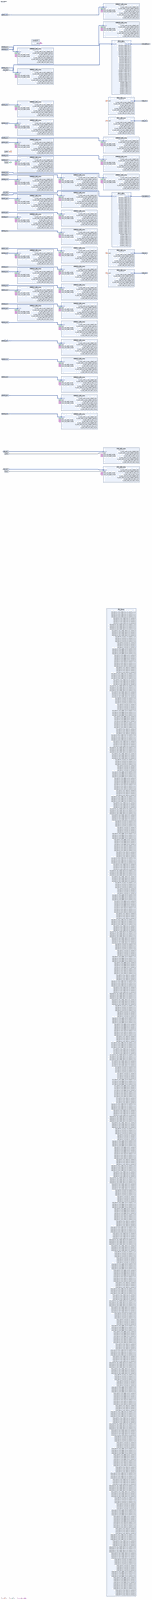
[diagram p0: block diagram of the top level, whole]
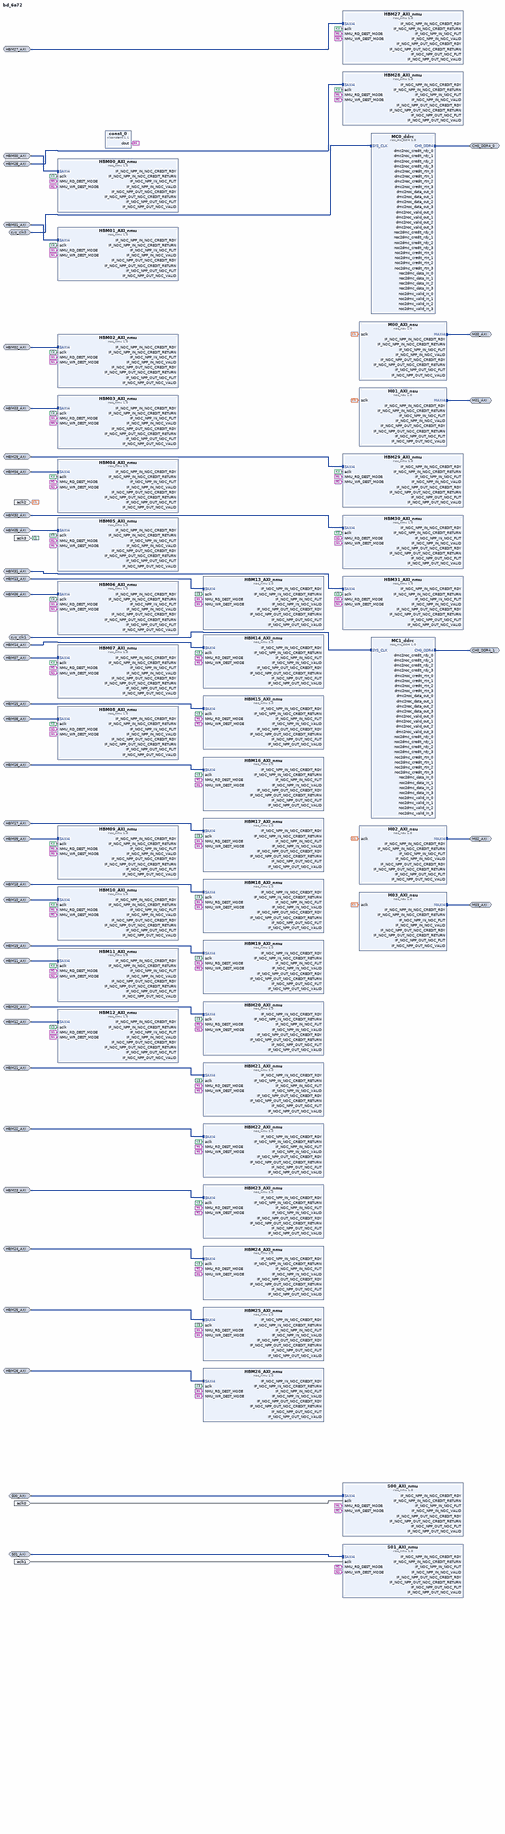
[diagram p1: block diagram of the top level, upper part]
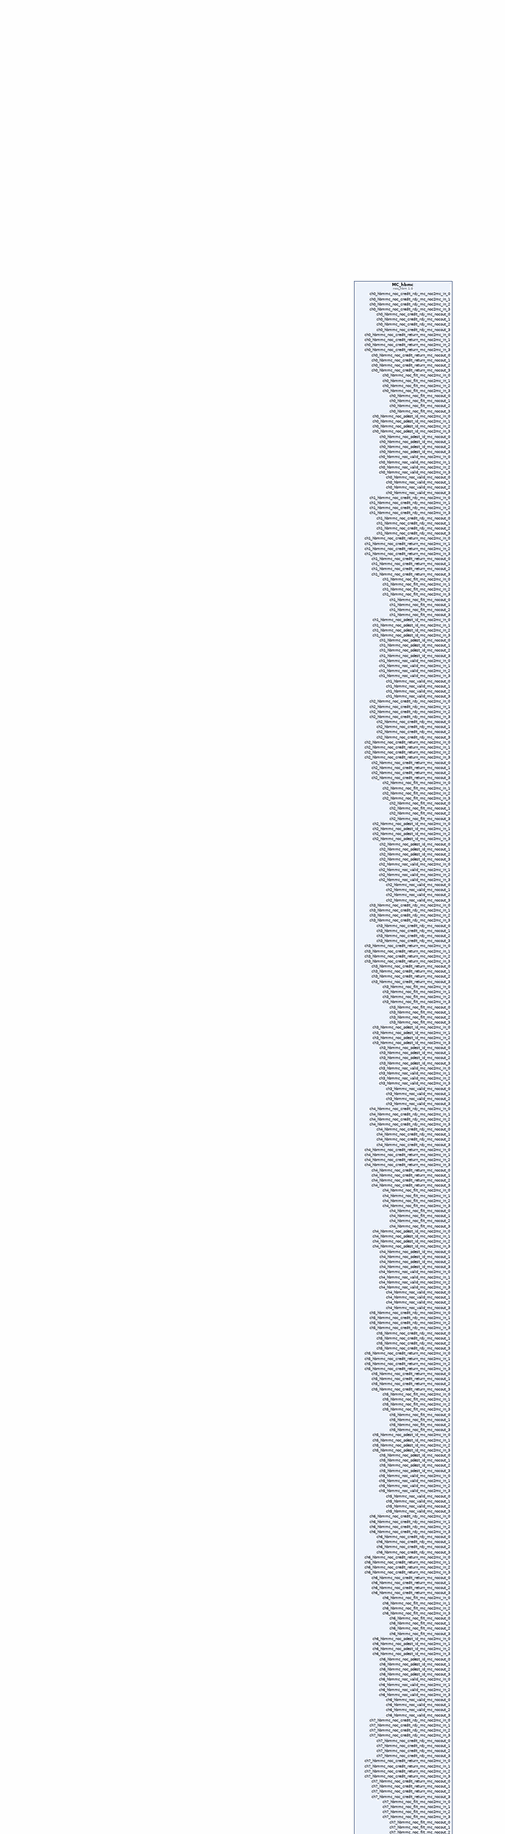
[diagram p2: block diagram of the top level, middle part]
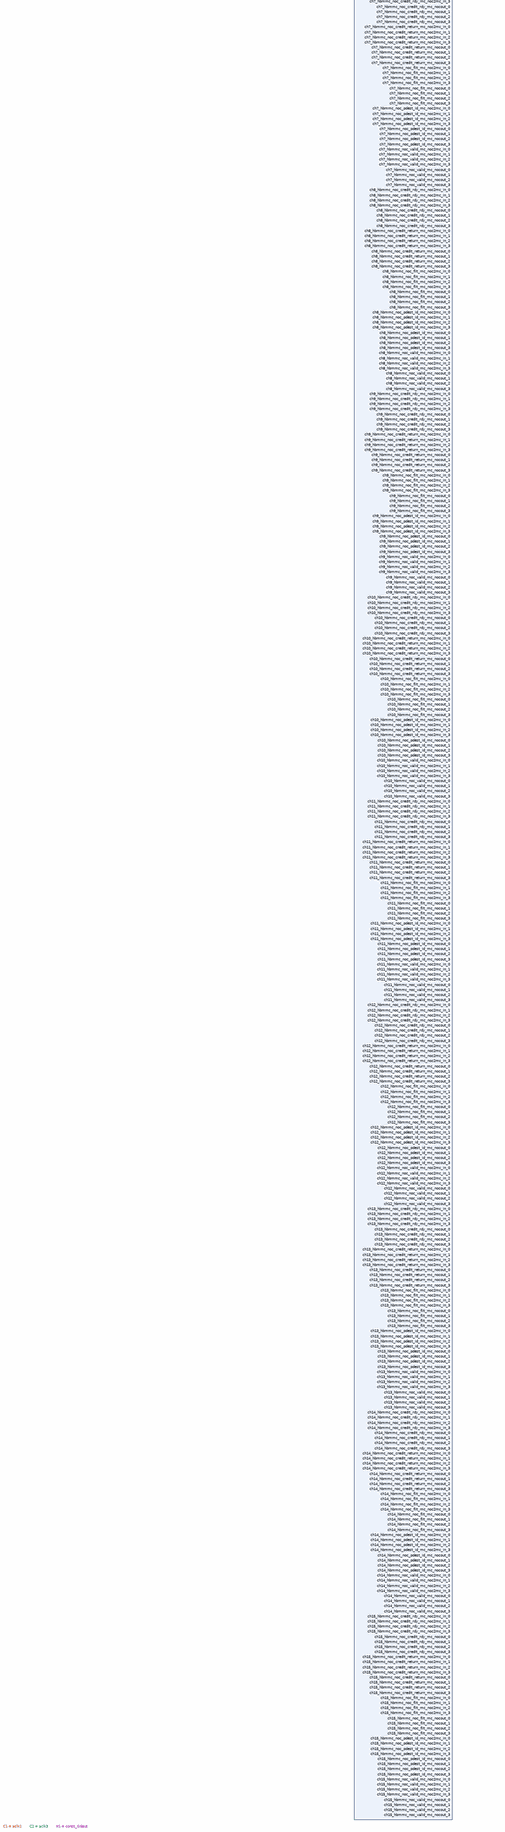
[diagram p3: block diagram of the top level, lower part]
# Vivado block design bd_6a72, xcvh1582-vsva3697-2MP-e-S, Vivado 2024.2
create_bd_design bd_6a72

create_bd_intf_port -mode Slave -vlnv xilinx.com:interface:aximm_rtl:1.0 S00_AXI
set_property -dict [list \
  CONFIG.CATEGORY ps_pcie \
  CONFIG.CONNECTIONS {['HBM10_PORT2 {read_bw {100} write_bw {100} read_avg_burst {4} write_avg_burst {4}}', 'HBM15_PORT0 {read_bw {100} write_bw {100} read_avg_burst {4} write_avg_burst {4}}', 'M01_AXI {read_bw {100} write_bw {100} read_avg_burst {4} write_avg_burst {4}}', 'HBM10_PORT0 {read_bw {100} write_bw {100} read_avg_burst {4} write_avg_burst {4}}', 'HBM5_PORT0 {read_bw {100} write_bw {100} read_avg_burst {4} write_avg_burst {4}}', 'HBM15_PORT2 {read_bw {100} write_bw {100} read_avg_burst {4} write_avg_burst {4}}', 'HBM5_PORT2 {read_bw {100} write_bw {100} read_avg_burst {4} write_avg_burst {4}}', 'HBM1_PORT0 {read_bw {100} write_bw {100} read_avg_burst {4} write_avg_burst {4}}', 'HBM1_PORT2 {read_bw {100} write_bw {100} read_avg_burst {4} write_avg_burst {4}}', 'HBM6_PORT0 {read_bw {100} write_bw {100} read_avg_burst {4} write_avg_burst {4}}', 'HBM12_PORT0 {read_bw {100} write_bw {100} read_avg_burst {4} write_avg_burst {4}}', 'HBM0_PORT2 {read_bw {100} write_bw {100} read_avg_burst {4} write_avg_burst {4}}', 'HBM6_PORT2 {read_bw {100} write_bw {100} read_avg_burst {4} write_avg_burst {4}}', 'HBM14_PORT2 {read_bw {100} write_bw {100} read_avg_burst {4} write_avg_burst {4}}', 'HBM12_PORT2 {read_bw {100} write_bw {100} read_avg_burst {4} write_avg_burst {4}}', 'M02_AXI {read_bw {100} write_bw {100} read_avg_burst {4} write_avg_burst {4}}', 'HBM0_PORT0 {read_bw {100} write_bw {100} read_avg_burst {4} write_avg_burst {4}}', 'HBM8_PORT0 {read_bw {100} write_bw {100} read_avg_burst {4} write_avg_burst {4}}', 'HBM8_PORT2 {read_bw {100} write_bw {100} read_avg_burst {4} write_avg_burst {4}}', 'HBM14_PORT0 {read_bw {100} write_bw {100} read_avg_burst {4} write_avg_burst {4}}', 'HBM3_PORT0 {read_bw {100} write_bw {100} read_avg_burst {4} write_avg_burst {4}}', 'HBM3_PORT2 {read_bw {100} write_bw {100} read_avg_burst {4} write_avg_burst {4}}', 'HBM4_PORT2 {read_bw {100} write_bw {100} read_avg_burst {4} write_avg_burst {4}}', 'M03_AXI {read_bw {100} write_bw {100} read_avg_burst {4} write_avg_burst {4}}', 'HBM4_PORT0 {read_bw {100} write_bw {100} read_avg_burst {4} write_avg_burst {4}}', 'MC_0 {read_bw {100} write_bw {100} read_avg_burst {4} write_avg_burst {4}}', 'HBM9_PORT0 {read_bw {100} write_bw {100} read_avg_burst {4} write_avg_burst {4}}', 'HBM2_PORT0 {read_bw {100} write_bw {100} read_avg_burst {4} write_avg_burst {4}}', 'HBM11_PORT0 {read_bw {100} write_bw {100} read_avg_burst {4} write_avg_burst {4}}', 'HBM9_PORT2 {read_bw {100} write_bw {100} read_avg_burst {4} write_avg_burst {4}}', 'HBM11_PORT2 {read_bw {100} write_bw {100} read_avg_burst {4} write_avg_burst {4}}', 'HBM7_PORT2 {read_bw {100} write_bw {100} read_avg_burst {4} write_avg_burst {4}}', 'HBM13_PORT2 {read_bw {100} write_bw {100} read_avg_burst {4} write_avg_burst {4}}', 'HBM7_PORT0 {read_bw {100} write_bw {100} read_avg_burst {4} write_avg_burst {4}}', 'HBM13_PORT0 {read_bw {100} write_bw {100} read_avg_burst {4} write_avg_burst {4}}', 'HBM2_PORT2 {read_bw {100} write_bw {100} read_avg_burst {4} write_avg_burst {4}}', 'M00_AXI {read_bw {100} write_bw {100} read_avg_burst {4} write_avg_burst {4}}']} \
  CONFIG.DEST_IDS M01_AXI:0x80:M02_AXI:0xc0:M03_AXI:0x40:M00_AXI:0x100 \
] [get_bd_intf_ports S00_AXI]
create_bd_intf_port -mode Slave -vlnv xilinx.com:interface:aximm_rtl:1.0 S01_AXI
set_property -dict [list \
  CONFIG.CATEGORY ps_pcie \
  CONFIG.CONNECTIONS {['HBM10_PORT2 {read_bw {100} write_bw {100} read_avg_burst {4} write_avg_burst {4}}', 'HBM15_PORT0 {read_bw {100} write_bw {100} read_avg_burst {4} write_avg_burst {4}}', 'M01_AXI {read_bw {100} write_bw {100} read_avg_burst {4} write_avg_burst {4}}', 'HBM10_PORT0 {read_bw {100} write_bw {100} read_avg_burst {4} write_avg_burst {4}}', 'HBM5_PORT0 {read_bw {100} write_bw {100} read_avg_burst {4} write_avg_burst {4}}', 'HBM15_PORT2 {read_bw {100} write_bw {100} read_avg_burst {4} write_avg_burst {4}}', 'HBM5_PORT2 {read_bw {100} write_bw {100} read_avg_burst {4} write_avg_burst {4}}', 'HBM1_PORT0 {read_bw {100} write_bw {100} read_avg_burst {4} write_avg_burst {4}}', 'HBM1_PORT2 {read_bw {100} write_bw {100} read_avg_burst {4} write_avg_burst {4}}', 'HBM6_PORT0 {read_bw {100} write_bw {100} read_avg_burst {4} write_avg_burst {4}}', 'HBM12_PORT0 {read_bw {100} write_bw {100} read_avg_burst {4} write_avg_burst {4}}', 'HBM0_PORT2 {read_bw {100} write_bw {100} read_avg_burst {4} write_avg_burst {4}}', 'HBM6_PORT2 {read_bw {100} write_bw {100} read_avg_burst {4} write_avg_burst {4}}', 'HBM14_PORT2 {read_bw {100} write_bw {100} read_avg_burst {4} write_avg_burst {4}}', 'HBM12_PORT2 {read_bw {100} write_bw {100} read_avg_burst {4} write_avg_burst {4}}', 'M02_AXI {read_bw {100} write_bw {100} read_avg_burst {4} write_avg_burst {4}}', 'HBM0_PORT0 {read_bw {100} write_bw {100} read_avg_burst {4} write_avg_burst {4}}', 'HBM8_PORT0 {read_bw {100} write_bw {100} read_avg_burst {4} write_avg_burst {4}}', 'HBM8_PORT2 {read_bw {100} write_bw {100} read_avg_burst {4} write_avg_burst {4}}', 'HBM14_PORT0 {read_bw {100} write_bw {100} read_avg_burst {4} write_avg_burst {4}}', 'HBM3_PORT0 {read_bw {100} write_bw {100} read_avg_burst {4} write_avg_burst {4}}', 'HBM3_PORT2 {read_bw {100} write_bw {100} read_avg_burst {4} write_avg_burst {4}}', 'HBM4_PORT2 {read_bw {100} write_bw {100} read_avg_burst {4} write_avg_burst {4}}', 'M03_AXI {read_bw {100} write_bw {100} read_avg_burst {4} write_avg_burst {4}}', 'HBM4_PORT0 {read_bw {100} write_bw {100} read_avg_burst {4} write_avg_burst {4}}', 'MC_0 {read_bw {100} write_bw {100} read_avg_burst {4} write_avg_burst {4}}', 'HBM9_PORT0 {read_bw {100} write_bw {100} read_avg_burst {4} write_avg_burst {4}}', 'HBM2_PORT0 {read_bw {100} write_bw {100} read_avg_burst {4} write_avg_burst {4}}', 'HBM11_PORT0 {read_bw {100} write_bw {100} read_avg_burst {4} write_avg_burst {4}}', 'HBM9_PORT2 {read_bw {100} write_bw {100} read_avg_burst {4} write_avg_burst {4}}', 'HBM11_PORT2 {read_bw {100} write_bw {100} read_avg_burst {4} write_avg_burst {4}}', 'HBM7_PORT2 {read_bw {100} write_bw {100} read_avg_burst {4} write_avg_burst {4}}', 'HBM13_PORT2 {read_bw {100} write_bw {100} read_avg_burst {4} write_avg_burst {4}}', 'HBM7_PORT0 {read_bw {100} write_bw {100} read_avg_burst {4} write_avg_burst {4}}', 'HBM13_PORT0 {read_bw {100} write_bw {100} read_avg_burst {4} write_avg_burst {4}}', 'HBM2_PORT2 {read_bw {100} write_bw {100} read_avg_burst {4} write_avg_burst {4}}', 'M00_AXI {read_bw {100} write_bw {100} read_avg_burst {4} write_avg_burst {4}}']} \
  CONFIG.DEST_IDS M01_AXI:0x80:M02_AXI:0xc0:M03_AXI:0x40:M00_AXI:0x100 \
] [get_bd_intf_ports S01_AXI]
create_bd_intf_port -mode Slave -vlnv xilinx.com:interface:aximm_rtl:1.0 HBM00_AXI
set_property -dict [list \
  CONFIG.CATEGORY pl_hbm \
  CONFIG.CONNECTIONS {HBM0_PORT0 {read_bw {12800} write_bw {6400} read_avg_burst {4} write_avg_burst {4}}} \
  CONFIG.DATA_WIDTH 256 \
  CONFIG.ID_WIDTH 6 \
  CONFIG.R_TRAFFIC_CLASS BEST_EFFORT \
] [get_bd_intf_ports HBM00_AXI]
create_bd_intf_port -mode Slave -vlnv xilinx.com:interface:aximm_rtl:1.0 HBM01_AXI
set_property -dict [list \
  CONFIG.CATEGORY pl_hbm \
  CONFIG.CONNECTIONS {HBM0_PORT2 {read_bw {12800} write_bw {6400} read_avg_burst {4} write_avg_burst {4}}} \
  CONFIG.DATA_WIDTH 256 \
  CONFIG.ID_WIDTH 6 \
] [get_bd_intf_ports HBM01_AXI]
create_bd_intf_port -mode Slave -vlnv xilinx.com:interface:aximm_rtl:1.0 HBM02_AXI
set_property -dict [list \
  CONFIG.CATEGORY pl_hbm \
  CONFIG.CONNECTIONS {HBM1_PORT0 {read_bw {12800} write_bw {6400} read_avg_burst {4} write_avg_burst {4}}} \
  CONFIG.DATA_WIDTH 256 \
  CONFIG.ID_WIDTH 6 \
] [get_bd_intf_ports HBM02_AXI]
create_bd_intf_port -mode Slave -vlnv xilinx.com:interface:aximm_rtl:1.0 HBM03_AXI
set_property -dict [list \
  CONFIG.CATEGORY pl_hbm \
  CONFIG.CONNECTIONS {HBM1_PORT2 {read_bw {12800} write_bw {6400} read_avg_burst {4} write_avg_burst {4}}} \
  CONFIG.DATA_WIDTH 256 \
  CONFIG.ID_WIDTH 6 \
] [get_bd_intf_ports HBM03_AXI]
create_bd_intf_port -mode Slave -vlnv xilinx.com:interface:aximm_rtl:1.0 HBM04_AXI
set_property -dict [list \
  CONFIG.CATEGORY pl_hbm \
  CONFIG.CONNECTIONS {HBM2_PORT0 {read_bw {12800} write_bw {6400} read_avg_burst {4} write_avg_burst {4}}} \
  CONFIG.DATA_WIDTH 256 \
  CONFIG.ID_WIDTH 6 \
] [get_bd_intf_ports HBM04_AXI]
create_bd_intf_port -mode Slave -vlnv xilinx.com:interface:aximm_rtl:1.0 HBM05_AXI
set_property -dict [list \
  CONFIG.CATEGORY pl_hbm \
  CONFIG.CONNECTIONS {HBM2_PORT2 {read_bw {12800} write_bw {6400} read_avg_burst {4} write_avg_burst {4}}} \
  CONFIG.DATA_WIDTH 256 \
  CONFIG.ID_WIDTH 6 \
] [get_bd_intf_ports HBM05_AXI]
create_bd_intf_port -mode Slave -vlnv xilinx.com:interface:aximm_rtl:1.0 HBM06_AXI
set_property -dict [list \
  CONFIG.CATEGORY pl_hbm \
  CONFIG.CONNECTIONS {HBM3_PORT0 {read_bw {12800} write_bw {6400} read_avg_burst {4} write_avg_burst {4}}} \
  CONFIG.DATA_WIDTH 256 \
  CONFIG.ID_WIDTH 6 \
] [get_bd_intf_ports HBM06_AXI]
create_bd_intf_port -mode Slave -vlnv xilinx.com:interface:aximm_rtl:1.0 HBM07_AXI
set_property -dict [list \
  CONFIG.CATEGORY pl_hbm \
  CONFIG.CONNECTIONS {HBM3_PORT2 {read_bw {12800} write_bw {6400} read_avg_burst {4} write_avg_burst {4}}} \
  CONFIG.DATA_WIDTH 256 \
  CONFIG.ID_WIDTH 6 \
] [get_bd_intf_ports HBM07_AXI]
create_bd_intf_port -mode Slave -vlnv xilinx.com:interface:aximm_rtl:1.0 HBM08_AXI
set_property -dict [list \
  CONFIG.CATEGORY pl_hbm \
  CONFIG.CONNECTIONS {HBM4_PORT0 {read_bw {12800} write_bw {6400} read_avg_burst {4} write_avg_burst {4}}} \
  CONFIG.DATA_WIDTH 256 \
  CONFIG.ID_WIDTH 6 \
] [get_bd_intf_ports HBM08_AXI]
create_bd_intf_port -mode Slave -vlnv xilinx.com:interface:aximm_rtl:1.0 HBM09_AXI
set_property -dict [list \
  CONFIG.CATEGORY pl_hbm \
  CONFIG.CONNECTIONS {HBM4_PORT2 {read_bw {12800} write_bw {6400} read_avg_burst {4} write_avg_burst {4}}} \
  CONFIG.DATA_WIDTH 256 \
  CONFIG.ID_WIDTH 6 \
] [get_bd_intf_ports HBM09_AXI]
create_bd_intf_port -mode Slave -vlnv xilinx.com:interface:aximm_rtl:1.0 HBM10_AXI
set_property -dict [list \
  CONFIG.CATEGORY pl_hbm \
  CONFIG.CONNECTIONS {HBM5_PORT0 {read_bw {12800} write_bw {6400} read_avg_burst {4} write_avg_burst {4}}} \
  CONFIG.DATA_WIDTH 256 \
  CONFIG.ID_WIDTH 6 \
] [get_bd_intf_ports HBM10_AXI]
create_bd_intf_port -mode Slave -vlnv xilinx.com:interface:aximm_rtl:1.0 HBM11_AXI
set_property -dict [list \
  CONFIG.CATEGORY pl_hbm \
  CONFIG.CONNECTIONS {HBM5_PORT2 {read_bw {12800} write_bw {6400} read_avg_burst {4} write_avg_burst {4}}} \
  CONFIG.DATA_WIDTH 256 \
  CONFIG.ID_WIDTH 6 \
] [get_bd_intf_ports HBM11_AXI]
create_bd_intf_port -mode Slave -vlnv xilinx.com:interface:aximm_rtl:1.0 HBM12_AXI
set_property -dict [list \
  CONFIG.CATEGORY pl_hbm \
  CONFIG.CONNECTIONS {HBM6_PORT0 {read_bw {12800} write_bw {6400} read_avg_burst {4} write_avg_burst {4}}} \
  CONFIG.DATA_WIDTH 256 \
  CONFIG.ID_WIDTH 6 \
] [get_bd_intf_ports HBM12_AXI]
create_bd_intf_port -mode Slave -vlnv xilinx.com:interface:aximm_rtl:1.0 HBM13_AXI
set_property -dict [list \
  CONFIG.CATEGORY pl_hbm \
  CONFIG.CONNECTIONS {HBM6_PORT2 {read_bw {12800} write_bw {6400} read_avg_burst {4} write_avg_burst {4}}} \
  CONFIG.DATA_WIDTH 256 \
  CONFIG.ID_WIDTH 6 \
] [get_bd_intf_ports HBM13_AXI]
create_bd_intf_port -mode Slave -vlnv xilinx.com:interface:aximm_rtl:1.0 HBM14_AXI
set_property -dict [list \
  CONFIG.CATEGORY pl_hbm \
  CONFIG.CONNECTIONS {HBM7_PORT0 {read_bw {12800} write_bw {6400} read_avg_burst {4} write_avg_burst {4}}} \
  CONFIG.DATA_WIDTH 256 \
  CONFIG.ID_WIDTH 6 \
] [get_bd_intf_ports HBM14_AXI]
create_bd_intf_port -mode Slave -vlnv xilinx.com:interface:aximm_rtl:1.0 HBM15_AXI
set_property -dict [list \
  CONFIG.CATEGORY pl_hbm \
  CONFIG.CONNECTIONS {HBM7_PORT2 {read_bw {12800} write_bw {6400} read_avg_burst {4} write_avg_burst {4}}} \
  CONFIG.DATA_WIDTH 256 \
  CONFIG.ID_WIDTH 6 \
] [get_bd_intf_ports HBM15_AXI]
create_bd_intf_port -mode Slave -vlnv xilinx.com:interface:aximm_rtl:1.0 HBM16_AXI
set_property -dict [list \
  CONFIG.CATEGORY pl_hbm \
  CONFIG.CONNECTIONS {HBM8_PORT0 {read_bw {12800} write_bw {6400} read_avg_burst {4} write_avg_burst {4}}} \
  CONFIG.DATA_WIDTH 256 \
  CONFIG.ID_WIDTH 6 \
] [get_bd_intf_ports HBM16_AXI]
create_bd_intf_port -mode Slave -vlnv xilinx.com:interface:aximm_rtl:1.0 HBM17_AXI
set_property -dict [list \
  CONFIG.CATEGORY pl_hbm \
  CONFIG.CONNECTIONS {HBM8_PORT2 {read_bw {12800} write_bw {6400} read_avg_burst {4} write_avg_burst {4}}} \
  CONFIG.DATA_WIDTH 256 \
  CONFIG.ID_WIDTH 6 \
] [get_bd_intf_ports HBM17_AXI]
create_bd_intf_port -mode Slave -vlnv xilinx.com:interface:aximm_rtl:1.0 HBM18_AXI
set_property -dict [list \
  CONFIG.CATEGORY pl_hbm \
  CONFIG.CONNECTIONS {HBM9_PORT0 {read_bw {12800} write_bw {6400} read_avg_burst {4} write_avg_burst {4}}} \
  CONFIG.DATA_WIDTH 256 \
  CONFIG.ID_WIDTH 6 \
] [get_bd_intf_ports HBM18_AXI]
create_bd_intf_port -mode Slave -vlnv xilinx.com:interface:aximm_rtl:1.0 HBM19_AXI
set_property -dict [list \
  CONFIG.CATEGORY pl_hbm \
  CONFIG.CONNECTIONS {HBM9_PORT2 {read_bw {12800} write_bw {6400} read_avg_burst {4} write_avg_burst {4}}} \
  CONFIG.DATA_WIDTH 256 \
  CONFIG.ID_WIDTH 6 \
] [get_bd_intf_ports HBM19_AXI]
create_bd_intf_port -mode Slave -vlnv xilinx.com:interface:aximm_rtl:1.0 HBM20_AXI
set_property -dict [list \
  CONFIG.CATEGORY pl_hbm \
  CONFIG.CONNECTIONS {HBM10_PORT0 {read_bw {12800} write_bw {6400} read_avg_burst {4} write_avg_burst {4}}} \
  CONFIG.DATA_WIDTH 256 \
  CONFIG.ID_WIDTH 6 \
] [get_bd_intf_ports HBM20_AXI]
create_bd_intf_port -mode Slave -vlnv xilinx.com:interface:aximm_rtl:1.0 HBM21_AXI
set_property -dict [list \
  CONFIG.CATEGORY pl_hbm \
  CONFIG.CONNECTIONS {HBM10_PORT2 {read_bw {12800} write_bw {6400} read_avg_burst {4} write_avg_burst {4}}} \
  CONFIG.DATA_WIDTH 256 \
  CONFIG.ID_WIDTH 6 \
] [get_bd_intf_ports HBM21_AXI]
create_bd_intf_port -mode Slave -vlnv xilinx.com:interface:aximm_rtl:1.0 HBM22_AXI
set_property -dict [list \
  CONFIG.CATEGORY pl_hbm \
  CONFIG.CONNECTIONS {HBM11_PORT0 {read_bw {12800} write_bw {6400} read_avg_burst {4} write_avg_burst {4}}} \
  CONFIG.DATA_WIDTH 256 \
  CONFIG.ID_WIDTH 6 \
] [get_bd_intf_ports HBM22_AXI]
create_bd_intf_port -mode Slave -vlnv xilinx.com:interface:aximm_rtl:1.0 HBM23_AXI
set_property -dict [list \
  CONFIG.CATEGORY pl_hbm \
  CONFIG.CONNECTIONS {HBM11_PORT2 {read_bw {12800} write_bw {6400} read_avg_burst {4} write_avg_burst {4}}} \
  CONFIG.DATA_WIDTH 256 \
  CONFIG.ID_WIDTH 6 \
] [get_bd_intf_ports HBM23_AXI]
create_bd_intf_port -mode Slave -vlnv xilinx.com:interface:aximm_rtl:1.0 HBM24_AXI
set_property -dict [list \
  CONFIG.CATEGORY pl_hbm \
  CONFIG.CONNECTIONS {HBM12_PORT0 {read_bw {12800} write_bw {6400} read_avg_burst {4} write_avg_burst {4}}} \
  CONFIG.DATA_WIDTH 256 \
  CONFIG.ID_WIDTH 6 \
] [get_bd_intf_ports HBM24_AXI]
create_bd_intf_port -mode Slave -vlnv xilinx.com:interface:aximm_rtl:1.0 HBM25_AXI
set_property -dict [list \
  CONFIG.CATEGORY pl_hbm \
  CONFIG.CONNECTIONS {HBM12_PORT2 {read_bw {12800} write_bw {6400} read_avg_burst {4} write_avg_burst {4}}} \
  CONFIG.DATA_WIDTH 256 \
  CONFIG.ID_WIDTH 6 \
] [get_bd_intf_ports HBM25_AXI]
create_bd_intf_port -mode Slave -vlnv xilinx.com:interface:aximm_rtl:1.0 HBM26_AXI
set_property -dict [list \
  CONFIG.CATEGORY pl_hbm \
  CONFIG.CONNECTIONS {HBM13_PORT0 {read_bw {12800} write_bw {6400} read_avg_burst {4} write_avg_burst {4}}} \
  CONFIG.DATA_WIDTH 256 \
  CONFIG.ID_WIDTH 6 \
] [get_bd_intf_ports HBM26_AXI]
create_bd_intf_port -mode Slave -vlnv xilinx.com:interface:aximm_rtl:1.0 HBM27_AXI
set_property -dict [list \
  CONFIG.CATEGORY pl_hbm \
  CONFIG.CONNECTIONS {HBM13_PORT2 {read_bw {12800} write_bw {6400} read_avg_burst {4} write_avg_burst {4}}} \
  CONFIG.DATA_WIDTH 256 \
  CONFIG.ID_WIDTH 6 \
] [get_bd_intf_ports HBM27_AXI]
create_bd_intf_port -mode Slave -vlnv xilinx.com:interface:aximm_rtl:1.0 HBM28_AXI
set_property -dict [list \
  CONFIG.CATEGORY pl_hbm \
  CONFIG.CONNECTIONS {HBM14_PORT0 {read_bw {12800} write_bw {6400} read_avg_burst {4} write_avg_burst {4}}} \
  CONFIG.DATA_WIDTH 256 \
  CONFIG.ID_WIDTH 6 \
] [get_bd_intf_ports HBM28_AXI]
create_bd_intf_port -mode Slave -vlnv xilinx.com:interface:aximm_rtl:1.0 HBM29_AXI
set_property -dict [list \
  CONFIG.CATEGORY pl_hbm \
  CONFIG.CONNECTIONS {HBM14_PORT2 {read_bw {12800} write_bw {6400} read_avg_burst {4} write_avg_burst {4}}} \
  CONFIG.DATA_WIDTH 256 \
  CONFIG.ID_WIDTH 6 \
] [get_bd_intf_ports HBM29_AXI]
create_bd_intf_port -mode Slave -vlnv xilinx.com:interface:aximm_rtl:1.0 HBM30_AXI
set_property -dict [list \
  CONFIG.CATEGORY pl_hbm \
  CONFIG.CONNECTIONS {HBM15_PORT0 {read_bw {12800} write_bw {6400} read_avg_burst {4} write_avg_burst {4}}} \
  CONFIG.DATA_WIDTH 256 \
  CONFIG.ID_WIDTH 6 \
] [get_bd_intf_ports HBM30_AXI]
create_bd_intf_port -mode Slave -vlnv xilinx.com:interface:aximm_rtl:1.0 HBM31_AXI
set_property -dict [list \
  CONFIG.CATEGORY pl_hbm \
  CONFIG.CONNECTIONS {HBM15_PORT2 {read_bw {12800} write_bw {6400} read_avg_burst {4} write_avg_burst {4}}} \
  CONFIG.DATA_WIDTH 256 \
  CONFIG.ID_WIDTH 6 \
] [get_bd_intf_ports HBM31_AXI]
create_bd_intf_port -mode Master -vlnv xilinx.com:interface:aximm_rtl:1.0 M00_AXI
set_property -dict {CONFIG.APERTURES {{0x201_0000_0000 1G}} CONFIG.CATEGORY pl} [get_bd_intf_ports M00_AXI]
create_bd_intf_port -mode Master -vlnv xilinx.com:interface:aximm_rtl:1.0 M01_AXI
set_property -dict {CONFIG.APERTURES {{0x201_4000_0000 1G}} CONFIG.CATEGORY pl} [get_bd_intf_ports M01_AXI]
create_bd_intf_port -mode Master -vlnv xilinx.com:interface:aximm_rtl:1.0 M02_AXI
set_property -dict {CONFIG.APERTURES {{0x201_8000_0000 1G}} CONFIG.CATEGORY pl} [get_bd_intf_ports M02_AXI]
create_bd_intf_port -mode Master -vlnv xilinx.com:interface:aximm_rtl:1.0 M03_AXI
set_property -dict {CONFIG.APERTURES {{0x202_0000_0000 1G}} CONFIG.CATEGORY pl} [get_bd_intf_ports M03_AXI]
create_bd_intf_port -mode Slave -vlnv xilinx.com:interface:diff_clock_rtl:1.0 sys_clk0
create_bd_intf_port -mode Master -vlnv xilinx.com:interface:ddr4_rtl:1.0 CH0_DDR4_0
create_bd_intf_port -mode Slave -vlnv xilinx.com:interface:diff_clock_rtl:1.0 sys_clk1
create_bd_intf_port -mode Master -vlnv xilinx.com:interface:ddr4_rtl:1.0 CH0_DDR4_1
create_bd_port -dir I -type clk aclk0
set_property -dict {CONFIG.ASSOCIATED_BUSIF S00_AXI} [get_bd_ports aclk0]
create_bd_port -dir I -type clk aclk1
set_property -dict {CONFIG.ASSOCIATED_BUSIF S01_AXI} [get_bd_ports aclk1]
create_bd_port -dir I -type clk aclk2
set_property -dict {CONFIG.ASSOCIATED_BUSIF M00_AXI:M01_AXI:M02_AXI:M03_AXI} [get_bd_ports aclk2]
create_bd_port -dir I -type clk aclk3
set_property -dict [list \
  CONFIG.ASSOCIATED_BUSIF HBM00_AXI:HBM01_AXI:HBM02_AXI:HBM03_AXI:HBM04_AXI:HBM05_AXI:HBM06_AXI:HBM07_AXI:HBM08_AXI:HBM09_AXI:HBM10_AXI:HBM11_AXI:HBM12_AXI:HBM13_AXI:HBM14_AXI:HBM15_AXI:HBM16_AXI:HBM17_AXI:HBM18_AXI:HBM19_AXI:HBM20_AXI:HBM21_AXI:HBM22_AXI:HBM23_AXI:HBM24_AXI:HBM25_AXI:HBM26_AXI:HBM27_AXI:HBM28_AXI:HBM29_AXI:HBM30_AXI:HBM31_AXI \
] [get_bd_ports aclk3]

create_bd_cell -type ip -vlnv xilinx.com:ip:noc_nmu:1.0 S01_AXI_nmu
set_property -dict [list \
  CONFIG.ATTR_FILE nocattrs.dat \
  CONFIG.NOC_FREQ 1000 \
  CONFIG.USER_NOC_CATEGORY PS \
  CONFIG.USER_NOC_DATA512_WIDTH 128 \
  CONFIG.USER_NOC_NMU_WIDTH 128 \
  CONFIG.USER_PHYS_NAME NOC_NMU128_X0Y1 \
  CONFIG.USER_REG_ADDR_DST0 0x00100 \
  CONFIG.USER_REG_ADDR_DST1 0x00080 \
  CONFIG.USER_REG_ADDR_DST2 0x000C0 \
  CONFIG.USER_REG_ADDR_DST3 0x00040 \
  CONFIG.USER_REG_ADDR_DST4 0x00000 \
  CONFIG.USER_REG_ADDR_DST5 0x00000 \
  CONFIG.USER_REG_ADDR_DST6 0x00000 \
  CONFIG.USER_REG_ADDR_DST7 0x00000 \
  CONFIG.USER_REG_ADDR_DST8 0x00000 \
  CONFIG.USER_REG_ADDR_DST9 0x00000 \
  CONFIG.USER_REG_ADDR_DST10 0x00000 \
  CONFIG.USER_REG_ADDR_DST11 0x00000 \
  CONFIG.USER_REG_ADDR_DST12 0x00000 \
  CONFIG.USER_REG_ADDR_DST13 0x00000 \
  CONFIG.USER_REG_ADDR_DST14 0x00000 \
  CONFIG.USER_REG_ADDR_DST15 0x00000 \
  CONFIG.USER_REG_ADDR_ENABLE 0x000F \
  CONFIG.USER_REG_ADDR_MADDR0 0x02010000 \
  CONFIG.USER_REG_ADDR_MADDR1 0x02014000 \
  CONFIG.USER_REG_ADDR_MADDR2 0x02018000 \
  CONFIG.USER_REG_ADDR_MADDR3 0x02020000 \
  CONFIG.USER_REG_ADDR_MADDR4 0x00000000 \
  CONFIG.USER_REG_ADDR_MADDR5 0x00000000 \
  CONFIG.USER_REG_ADDR_MADDR6 0x00000000 \
  CONFIG.USER_REG_ADDR_MADDR7 0x00000000 \
  CONFIG.USER_REG_ADDR_MADDR8 0x00000000 \
  CONFIG.USER_REG_ADDR_MADDR9 0x00000000 \
  CONFIG.USER_REG_ADDR_MADDR10 0x00000000 \
  CONFIG.USER_REG_ADDR_MADDR11 0x00000000 \
  CONFIG.USER_REG_ADDR_MADDR12 0x00000000 \
  CONFIG.USER_REG_ADDR_MADDR13 0x00000000 \
  CONFIG.USER_REG_ADDR_MADDR14 0x00000000 \
  CONFIG.USER_REG_ADDR_MADDR15 0x00000000 \
  CONFIG.USER_REG_ADDR_MASK0 0xffffffff \
  CONFIG.USER_REG_ADDR_MASK1 0xffffffff \
  CONFIG.USER_REG_ADDR_MASK2 0xffffffff \
  CONFIG.USER_REG_ADDR_MASK3 0xffffffff \
  CONFIG.USER_REG_ADDR_MASK4 0x00000000 \
  CONFIG.USER_REG_ADDR_MASK5 0x00000000 \
  CONFIG.USER_REG_ADDR_MASK6 0x00000000 \
  CONFIG.USER_REG_ADDR_MASK7 0x00000000 \
  CONFIG.USER_REG_ADDR_MASK8 0x00000000 \
  CONFIG.USER_REG_ADDR_MASK9 0x00000000 \
  CONFIG.USER_REG_ADDR_MASK10 0x00000000 \
  CONFIG.USER_REG_ADDR_MASK11 0x00000000 \
  CONFIG.USER_REG_ADDR_MASK12 0x00000000 \
  CONFIG.USER_REG_ADDR_MASK13 0x00000000 \
  CONFIG.USER_REG_ADDR_MASK14 0x00000000 \
  CONFIG.USER_REG_ADDR_MASK15 0x00000000 \
  CONFIG.USER_REG_ADDR_REMAP 0x000F \
  CONFIG.USER_REG_ADDR_RPADDR0 0x02010000 \
  CONFIG.USER_REG_ADDR_RPADDR1 0x02014000 \
  CONFIG.USER_REG_ADDR_RPADDR2 0x02018000 \
  CONFIG.USER_REG_ADDR_RPADDR3 0x02020000 \
  CONFIG.USER_REG_ADDR_RPADDR4 0x00000000 \
  CONFIG.USER_REG_ADDR_RPADDR5 0x00000000 \
  CONFIG.USER_REG_ADDR_RPADDR6 0x00000000 \
  CONFIG.USER_REG_ADDR_RPADDR7 0x00000000 \
  CONFIG.USER_REG_ADDR_RPADDR8 0x00000000 \
  CONFIG.USER_REG_ADDR_RPADDR9 0x00000000 \
  CONFIG.USER_REG_ADDR_RPADDR10 0x00000000 \
  CONFIG.USER_REG_ADDR_RPADDR11 0x00000000 \
  CONFIG.USER_REG_ADDR_RPADDR12 0x00000000 \
  CONFIG.USER_REG_ADDR_RPADDR13 0x00000000 \
  CONFIG.USER_REG_ADDR_RPADDR14 0x00000000 \
  CONFIG.USER_REG_ADDR_RPADDR15 0x00000000 \
  CONFIG.USER_REG_ADR_MAP_CPM 0x0FC0 \
  CONFIG.USER_REG_ADR_MAP_FPD_AFI_0 0x0FC0 \
  CONFIG.USER_REG_ADR_MAP_FPD_AFI_1 0x0FC0 \
  CONFIG.USER_REG_ADR_MAP_LPD_AFI_FS 0x0FC0 \
  CONFIG.USER_REG_ADR_MAP_ME_ARRAY_0 0x0FC0 \
  CONFIG.USER_REG_ADR_MAP_ME_ARRAY_1 0x0FC0 \
  CONFIG.USER_REG_ADR_MAP_ME_ARRAY_2 0x0FC0 \
  CONFIG.USER_REG_ADR_MAP_ME_ARRAY_3 0x0FC0 \
  CONFIG.USER_REG_ADR_MAP_PCIE 0x0FC0 \
  CONFIG.USER_REG_ADR_MAP_PMC 0x0FC0 \
  CONFIG.USER_REG_ADR_MAP_PMC_ALIAS_0 0x0FC0 \
  CONFIG.USER_REG_ADR_MAP_PMC_ALIAS_1 0x0FC0 \
  CONFIG.USER_REG_ADR_MAP_PMC_ALIAS_2 0x0FC0 \
  CONFIG.USER_REG_ADR_MAP_PMC_ALIAS_3 0x0FC0 \
  CONFIG.USER_REG_ADR_MAP_QSPI 0x0FC0 \
  CONFIG.USER_REG_ADR_MAP_STM_GIC 0x0FC0 \
  CONFIG.USER_REG_ADR_MAP_XPDS 0x0FC0 \
  CONFIG.USER_REG_AXI_LOOPBACK 0x00 \
  CONFIG.USER_REG_AXI_NON_MOD_DISABLE 0x0 \
  CONFIG.USER_REG_AXI_PAR_CHK 0x0 \
  CONFIG.USER_REG_CHOPSIZE 0xA \
  CONFIG.USER_REG_DDR_ADR_MAP0 0x01208 \
  CONFIG.USER_REG_DDR_ADR_MAP1 0x01FFF \
  CONFIG.USER_REG_DDR_ADR_MAP2 0x01FFF \
  CONFIG.USER_REG_DDR_ADR_MAP3 0x01FFF \
  CONFIG.USER_REG_DDR_ADR_MAP4 0x01FFF \
  CONFIG.USER_REG_DDR_ADR_MAP5 0x01FFF \
  CONFIG.USER_REG_DDR_ADR_MAP6 0x01FFF \
  CONFIG.USER_REG_DDR_DST_MAP0 0xA40 \
  CONFIG.USER_REG_DDR_DST_MAP1 0xA00 \
  CONFIG.USER_REG_DDR_DST_MAP2 0xFC0 \
  CONFIG.USER_REG_DDR_DST_MAP3 0xFC0 \
  CONFIG.USER_REG_DDR_DST_MAP4 0xFC0 \
  CONFIG.USER_REG_DDR_DST_MAP5 0xFC0 \
  CONFIG.USER_REG_DDR_DST_MAP6 0xFC0 \
  CONFIG.USER_REG_DDR_DST_MAP7 0xFC0 \
  CONFIG.USER_REG_DWIDTH 0x4 \
  CONFIG.USER_REG_ECC_CHK_EN 0x1 \
  CONFIG.USER_REG_HBM_MAP_T0_CH0 0x0140 \
  CONFIG.USER_REG_HBM_MAP_T0_CH1 0x0AC0 \
  CONFIG.USER_REG_HBM_MAP_T0_CH2 0x0B00 \
  CONFIG.USER_REG_HBM_MAP_T0_CH3 0x0B40 \
  CONFIG.USER_REG_HBM_MAP_T0_CH4 0x0200 \
  CONFIG.USER_REG_HBM_MAP_T0_CH5 0x0BC0 \
  CONFIG.USER_REG_HBM_MAP_T0_CH6 0x0C00 \
  CONFIG.USER_REG_HBM_MAP_T0_CH7 0x0C40 \
  CONFIG.USER_REG_HBM_MAP_T0_CH8 0x0340 \
  CONFIG.USER_REG_HBM_MAP_T0_CH9 0x0CC0 \
  CONFIG.USER_REG_HBM_MAP_T0_CH10 0x0D00 \
  CONFIG.USER_REG_HBM_MAP_T0_CH11 0x0D40 \
  CONFIG.USER_REG_HBM_MAP_T0_CH12 0x0480 \
  CONFIG.USER_REG_HBM_MAP_T0_CH13 0x0DC0 \
  CONFIG.USER_REG_HBM_MAP_T0_CH14 0x0E00 \
  CONFIG.USER_REG_HBM_MAP_T0_CH15 0x0E40 \
  CONFIG.USER_REG_HBM_MAP_T1_CH0 0x0580 \
  CONFIG.USER_REG_HBM_MAP_T1_CH1 0x0EC0 \
  CONFIG.USER_REG_HBM_MAP_T1_CH2 0x0F00 \
  CONFIG.USER_REG_HBM_MAP_T1_CH3 0x0F40 \
  CONFIG.USER_REG_HBM_MAP_T1_CH4 0x0680 \
  CONFIG.USER_REG_HBM_MAP_T1_CH5 0x0FC0 \
  CONFIG.USER_REG_HBM_MAP_T1_CH6 0x0240 \
  CONFIG.USER_REG_HBM_MAP_T1_CH7 0x0380 \
  CONFIG.USER_REG_HBM_MAP_T1_CH8 0x0780 \
  CONFIG.USER_REG_HBM_MAP_T1_CH9 0x0A80 \
  CONFIG.USER_REG_HBM_MAP_T1_CH10 0x0B80 \
  CONFIG.USER_REG_HBM_MAP_T1_CH11 0x0C80 \
  CONFIG.USER_REG_HBM_MAP_T1_CH12 0x0880 \
  CONFIG.USER_REG_HBM_MAP_T1_CH13 0x0D80 \
  CONFIG.USER_REG_HBM_MAP_T1_CH14 0x0E80 \
  CONFIG.USER_REG_HBM_MAP_T1_CH15 0x0F80 \
  CONFIG.USER_REG_HBM_MAP_T2_CH0 0x0FC0 \
  CONFIG.USER_REG_HBM_MAP_T2_CH1 0x0FC0 \
  CONFIG.USER_REG_HBM_MAP_T2_CH2 0x0FC0 \
  CONFIG.USER_REG_HBM_MAP_T2_CH3 0x0FC0 \
  CONFIG.USER_REG_HBM_MAP_T2_CH4 0x0FC0 \
  CONFIG.USER_REG_HBM_MAP_T2_CH5 0x0FC0 \
  CONFIG.USER_REG_HBM_MAP_T2_CH6 0x0FC0 \
  CONFIG.USER_REG_HBM_MAP_T2_CH7 0x0FC0 \
  CONFIG.USER_REG_HBM_MAP_T2_CH8 0x0FC0 \
  CONFIG.USER_REG_HBM_MAP_T2_CH9 0x0FC0 \
  CONFIG.USER_REG_HBM_MAP_T2_CH10 0x0FC0 \
  CONFIG.USER_REG_HBM_MAP_T2_CH11 0x0FC0 \
  CONFIG.USER_REG_HBM_MAP_T2_CH12 0x0FC0 \
  CONFIG.USER_REG_HBM_MAP_T2_CH13 0x0FC0 \
  CONFIG.USER_REG_HBM_MAP_T2_CH14 0x0FC0 \
  CONFIG.USER_REG_HBM_MAP_T2_CH15 0x0FC0 \
  CONFIG.USER_REG_HBM_MAP_T3_CH0 0x0FC0 \
  CONFIG.USER_REG_HBM_MAP_T3_CH1 0x0FC0 \
  CONFIG.USER_REG_HBM_MAP_T3_CH2 0x0FC0 \
  CONFIG.USER_REG_HBM_MAP_T3_CH3 0x0FC0 \
  CONFIG.USER_REG_HBM_MAP_T3_CH4 0x0FC0 \
  CONFIG.USER_REG_HBM_MAP_T3_CH5 0x0FC0 \
  CONFIG.USER_REG_HBM_MAP_T3_CH6 0x0FC0 \
  CONFIG.USER_REG_HBM_MAP_T3_CH7 0x0FC0 \
  CONFIG.USER_REG_HBM_MAP_T3_CH8 0x0FC0 \
  CONFIG.USER_REG_HBM_MAP_T3_CH9 0x0FC0 \
  CONFIG.USER_REG_HBM_MAP_T3_CH10 0x0FC0 \
  CONFIG.USER_REG_HBM_MAP_T3_CH11 0x0FC0 \
  CONFIG.USER_REG_HBM_MAP_T3_CH12 0x0FC0 \
  CONFIG.USER_REG_HBM_MAP_T3_CH13 0x0FC0 \
  CONFIG.USER_REG_HBM_MAP_T3_CH14 0x0FC0 \
  CONFIG.USER_REG_HBM_MAP_T3_CH15 0x0FC0 \
  CONFIG.USER_REG_MODE_SELECT 0x0020 \
  CONFIG.USER_REG_OUTSTANDING_RD_TXN 0x40 \
  CONFIG.USER_REG_OUTSTANDING_WR_TXN 0x40 \
  CONFIG.USER_REG_PRIORITY 0x0 \
  CONFIG.USER_REG_RD_AXPROT_SEL 0x00 \
  CONFIG.USER_REG_RD_RATE_CREDIT_DROP 0x004 \
  CONFIG.USER_REG_RD_RATE_CREDIT_LIMIT 0x0100 \
  CONFIG.USER_REG_RD_VCA_TOKEN0 0x33 \
  CONFIG.USER_REG_RPOISON_TO_SLVERR 0x0 \
  CONFIG.USER_REG_RROB_RAM_SETTING 0x012 \
  CONFIG.USER_REG_SMID_SEL 0x00000 \
  CONFIG.USER_REG_SRC 0x9C0 \
  CONFIG.USER_REG_TBASE_AXI_TIMEOUT 0x1 \
  CONFIG.USER_REG_TBASE_MODE_RLIMIT_RD 0x2 \
  CONFIG.USER_REG_TBASE_MODE_RLIMIT_WR 0x2 \
  CONFIG.USER_REG_TBASE_TRK_TIMEOUT 0x1 \
  CONFIG.USER_REG_VC_MAP 0x6A8 \
  CONFIG.USER_REG_WBUF_LAUNCH_SIZE 0x10 \
  CONFIG.USER_REG_WBUF_RAM_SETTING 0x012 \
  CONFIG.USER_REG_WR_AXPROT_SEL 0x00 \
  CONFIG.USER_REG_WR_RATE_CREDIT_DROP 0x004 \
  CONFIG.USER_REG_WR_RATE_CREDIT_LIMIT 0x0100 \
  CONFIG.USER_REG_WR_VCA_TOKEN0 0xFF \
] [get_bd_cells S01_AXI_nmu]
create_bd_cell -type ip -vlnv xilinx.com:ip:xlconstant:1.1 const_0
set_property -dict {CONFIG.CONST_VAL 0 CONFIG.CONST_WIDTH 1} [get_bd_cells const_0]
create_bd_cell -type ip -vlnv xilinx.com:ip:noc_nmu:1.0 S00_AXI_nmu
set_property -dict [list \
  CONFIG.ATTR_FILE nocattrs.dat \
  CONFIG.NOC_FREQ 1000 \
  CONFIG.USER_NOC_CATEGORY PS \
  CONFIG.USER_NOC_DATA512_WIDTH 128 \
  CONFIG.USER_NOC_NMU_WIDTH 128 \
  CONFIG.USER_PHYS_NAME NOC_NMU128_X0Y0 \
  CONFIG.USER_REG_ADDR_DST0 0x00100 \
  CONFIG.USER_REG_ADDR_DST1 0x00080 \
  CONFIG.USER_REG_ADDR_DST2 0x000C0 \
  CONFIG.USER_REG_ADDR_DST3 0x00040 \
  CONFIG.USER_REG_ADDR_DST4 0x00000 \
  CONFIG.USER_REG_ADDR_DST5 0x00000 \
  CONFIG.USER_REG_ADDR_DST6 0x00000 \
  CONFIG.USER_REG_ADDR_DST7 0x00000 \
  CONFIG.USER_REG_ADDR_DST8 0x00000 \
  CONFIG.USER_REG_ADDR_DST9 0x00000 \
  CONFIG.USER_REG_ADDR_DST10 0x00000 \
  CONFIG.USER_REG_ADDR_DST11 0x00000 \
  CONFIG.USER_REG_ADDR_DST12 0x00000 \
  CONFIG.USER_REG_ADDR_DST13 0x00000 \
  CONFIG.USER_REG_ADDR_DST14 0x00000 \
  CONFIG.USER_REG_ADDR_DST15 0x00000 \
  CONFIG.USER_REG_ADDR_ENABLE 0x000F \
  CONFIG.USER_REG_ADDR_MADDR0 0x02010000 \
  CONFIG.USER_REG_ADDR_MADDR1 0x02014000 \
  CONFIG.USER_REG_ADDR_MADDR2 0x02018000 \
  CONFIG.USER_REG_ADDR_MADDR3 0x02020000 \
  CONFIG.USER_REG_ADDR_MADDR4 0x00000000 \
  CONFIG.USER_REG_ADDR_MADDR5 0x00000000 \
  CONFIG.USER_REG_ADDR_MADDR6 0x00000000 \
  CONFIG.USER_REG_ADDR_MADDR7 0x00000000 \
  CONFIG.USER_REG_ADDR_MADDR8 0x00000000 \
  CONFIG.USER_REG_ADDR_MADDR9 0x00000000 \
  CONFIG.USER_REG_ADDR_MADDR10 0x00000000 \
  CONFIG.USER_REG_ADDR_MADDR11 0x00000000 \
  CONFIG.USER_REG_ADDR_MADDR12 0x00000000 \
  CONFIG.USER_REG_ADDR_MADDR13 0x00000000 \
  CONFIG.USER_REG_ADDR_MADDR14 0x00000000 \
  CONFIG.USER_REG_ADDR_MADDR15 0x00000000 \
  CONFIG.USER_REG_ADDR_MASK0 0xffffffff \
  CONFIG.USER_REG_ADDR_MASK1 0xffffffff \
  CONFIG.USER_REG_ADDR_MASK2 0xffffffff \
  CONFIG.USER_REG_ADDR_MASK3 0xffffffff \
  CONFIG.USER_REG_ADDR_MASK4 0x00000000 \
  CONFIG.USER_REG_ADDR_MASK5 0x00000000 \
  CONFIG.USER_REG_ADDR_MASK6 0x00000000 \
  CONFIG.USER_REG_ADDR_MASK7 0x00000000 \
  CONFIG.USER_REG_ADDR_MASK8 0x00000000 \
  CONFIG.USER_REG_ADDR_MASK9 0x00000000 \
  CONFIG.USER_REG_ADDR_MASK10 0x00000000 \
  CONFIG.USER_REG_ADDR_MASK11 0x00000000 \
  CONFIG.USER_REG_ADDR_MASK12 0x00000000 \
  CONFIG.USER_REG_ADDR_MASK13 0x00000000 \
  CONFIG.USER_REG_ADDR_MASK14 0x00000000 \
  CONFIG.USER_REG_ADDR_MASK15 0x00000000 \
  CONFIG.USER_REG_ADDR_REMAP 0x000F \
  CONFIG.USER_REG_ADDR_RPADDR0 0x02010000 \
  CONFIG.USER_REG_ADDR_RPADDR1 0x02014000 \
  CONFIG.USER_REG_ADDR_RPADDR2 0x02018000 \
  CONFIG.USER_REG_ADDR_RPADDR3 0x02020000 \
  CONFIG.USER_REG_ADDR_RPADDR4 0x00000000 \
  CONFIG.USER_REG_ADDR_RPADDR5 0x00000000 \
  CONFIG.USER_REG_ADDR_RPADDR6 0x00000000 \
  CONFIG.USER_REG_ADDR_RPADDR7 0x00000000 \
  CONFIG.USER_REG_ADDR_RPADDR8 0x00000000 \
  CONFIG.USER_REG_ADDR_RPADDR9 0x00000000 \
  CONFIG.USER_REG_ADDR_RPADDR10 0x00000000 \
  CONFIG.USER_REG_ADDR_RPADDR11 0x00000000 \
  CONFIG.USER_REG_ADDR_RPADDR12 0x00000000 \
  CONFIG.USER_REG_ADDR_RPADDR13 0x00000000 \
  CONFIG.USER_REG_ADDR_RPADDR14 0x00000000 \
  CONFIG.USER_REG_ADDR_RPADDR15 0x00000000 \
  CONFIG.USER_REG_ADR_MAP_CPM 0x0FC0 \
  CONFIG.USER_REG_ADR_MAP_FPD_AFI_0 0x0FC0 \
  CONFIG.USER_REG_ADR_MAP_FPD_AFI_1 0x0FC0 \
  CONFIG.USER_REG_ADR_MAP_LPD_AFI_FS 0x0FC0 \
  CONFIG.USER_REG_ADR_MAP_ME_ARRAY_0 0x0FC0 \
  CONFIG.USER_REG_ADR_MAP_ME_ARRAY_1 0x0FC0 \
  CONFIG.USER_REG_ADR_MAP_ME_ARRAY_2 0x0FC0 \
  CONFIG.USER_REG_ADR_MAP_ME_ARRAY_3 0x0FC0 \
  CONFIG.USER_REG_ADR_MAP_PCIE 0x0FC0 \
  CONFIG.USER_REG_ADR_MAP_PMC 0x0FC0 \
  CONFIG.USER_REG_ADR_MAP_PMC_ALIAS_0 0x0FC0 \
  CONFIG.USER_REG_ADR_MAP_PMC_ALIAS_1 0x0FC0 \
  CONFIG.USER_REG_ADR_MAP_PMC_ALIAS_2 0x0FC0 \
  CONFIG.USER_REG_ADR_MAP_PMC_ALIAS_3 0x0FC0 \
  CONFIG.USER_REG_ADR_MAP_QSPI 0x0FC0 \
  CONFIG.USER_REG_ADR_MAP_STM_GIC 0x0FC0 \
  CONFIG.USER_REG_ADR_MAP_XPDS 0x0FC0 \
  CONFIG.USER_REG_AXI_LOOPBACK 0x00 \
  CONFIG.USER_REG_AXI_NON_MOD_DISABLE 0x0 \
  CONFIG.USER_REG_AXI_PAR_CHK 0x0 \
  CONFIG.USER_REG_CHOPSIZE 0xA \
  CONFIG.USER_REG_DDR_ADR_MAP0 0x01208 \
  CONFIG.USER_REG_DDR_ADR_MAP1 0x01FFF \
  CONFIG.USER_REG_DDR_ADR_MAP2 0x01FFF \
  CONFIG.USER_REG_DDR_ADR_MAP3 0x01FFF \
  CONFIG.USER_REG_DDR_ADR_MAP4 0x01FFF \
  CONFIG.USER_REG_DDR_ADR_MAP5 0x01FFF \
  CONFIG.USER_REG_DDR_ADR_MAP6 0x01FFF \
  CONFIG.USER_REG_DDR_DST_MAP0 0xA40 \
  CONFIG.USER_REG_DDR_DST_MAP1 0xA00 \
  CONFIG.USER_REG_DDR_DST_MAP2 0xFC0 \
  CONFIG.USER_REG_DDR_DST_MAP3 0xFC0 \
  CONFIG.USER_REG_DDR_DST_MAP4 0xFC0 \
  CONFIG.USER_REG_DDR_DST_MAP5 0xFC0 \
  CONFIG.USER_REG_DDR_DST_MAP6 0xFC0 \
  CONFIG.USER_REG_DDR_DST_MAP7 0xFC0 \
  CONFIG.USER_REG_DWIDTH 0x4 \
  CONFIG.USER_REG_ECC_CHK_EN 0x1 \
  CONFIG.USER_REG_HBM_MAP_T0_CH0 0x0140 \
  CONFIG.USER_REG_HBM_MAP_T0_CH1 0x0AC0 \
  CONFIG.USER_REG_HBM_MAP_T0_CH2 0x0B00 \
  CONFIG.USER_REG_HBM_MAP_T0_CH3 0x0B40 \
  CONFIG.USER_REG_HBM_MAP_T0_CH4 0x0200 \
  CONFIG.USER_REG_HBM_MAP_T0_CH5 0x0BC0 \
  CONFIG.USER_REG_HBM_MAP_T0_CH6 0x0C00 \
  CONFIG.USER_REG_HBM_MAP_T0_CH7 0x0C40 \
  CONFIG.USER_REG_HBM_MAP_T0_CH8 0x0340 \
  CONFIG.USER_REG_HBM_MAP_T0_CH9 0x0CC0 \
  CONFIG.USER_REG_HBM_MAP_T0_CH10 0x0D00 \
  CONFIG.USER_REG_HBM_MAP_T0_CH11 0x0D40 \
  CONFIG.USER_REG_HBM_MAP_T0_CH12 0x0480 \
  CONFIG.USER_REG_HBM_MAP_T0_CH13 0x0DC0 \
  CONFIG.USER_REG_HBM_MAP_T0_CH14 0x0E00 \
  CONFIG.USER_REG_HBM_MAP_T0_CH15 0x0E40 \
  CONFIG.USER_REG_HBM_MAP_T1_CH0 0x0580 \
  CONFIG.USER_REG_HBM_MAP_T1_CH1 0x0EC0 \
  CONFIG.USER_REG_HBM_MAP_T1_CH2 0x0F00 \
  CONFIG.USER_REG_HBM_MAP_T1_CH3 0x0F40 \
  CONFIG.USER_REG_HBM_MAP_T1_CH4 0x0680 \
  CONFIG.USER_REG_HBM_MAP_T1_CH5 0x0FC0 \
  CONFIG.USER_REG_HBM_MAP_T1_CH6 0x0240 \
  CONFIG.USER_REG_HBM_MAP_T1_CH7 0x0380 \
  CONFIG.USER_REG_HBM_MAP_T1_CH8 0x0780 \
  CONFIG.USER_REG_HBM_MAP_T1_CH9 0x0A80 \
  CONFIG.USER_REG_HBM_MAP_T1_CH10 0x0B80 \
  CONFIG.USER_REG_HBM_MAP_T1_CH11 0x0C80 \
  CONFIG.USER_REG_HBM_MAP_T1_CH12 0x0880 \
  CONFIG.USER_REG_HBM_MAP_T1_CH13 0x0D80 \
  CONFIG.USER_REG_HBM_MAP_T1_CH14 0x0E80 \
  CONFIG.USER_REG_HBM_MAP_T1_CH15 0x0F80 \
  CONFIG.USER_REG_HBM_MAP_T2_CH0 0x0FC0 \
  CONFIG.USER_REG_HBM_MAP_T2_CH1 0x0FC0 \
  CONFIG.USER_REG_HBM_MAP_T2_CH2 0x0FC0 \
  CONFIG.USER_REG_HBM_MAP_T2_CH3 0x0FC0 \
  CONFIG.USER_REG_HBM_MAP_T2_CH4 0x0FC0 \
  CONFIG.USER_REG_HBM_MAP_T2_CH5 0x0FC0 \
  CONFIG.USER_REG_HBM_MAP_T2_CH6 0x0FC0 \
  CONFIG.USER_REG_HBM_MAP_T2_CH7 0x0FC0 \
  CONFIG.USER_REG_HBM_MAP_T2_CH8 0x0FC0 \
  CONFIG.USER_REG_HBM_MAP_T2_CH9 0x0FC0 \
  CONFIG.USER_REG_HBM_MAP_T2_CH10 0x0FC0 \
  CONFIG.USER_REG_HBM_MAP_T2_CH11 0x0FC0 \
  CONFIG.USER_REG_HBM_MAP_T2_CH12 0x0FC0 \
  CONFIG.USER_REG_HBM_MAP_T2_CH13 0x0FC0 \
  CONFIG.USER_REG_HBM_MAP_T2_CH14 0x0FC0 \
  CONFIG.USER_REG_HBM_MAP_T2_CH15 0x0FC0 \
  CONFIG.USER_REG_HBM_MAP_T3_CH0 0x0FC0 \
  CONFIG.USER_REG_HBM_MAP_T3_CH1 0x0FC0 \
  CONFIG.USER_REG_HBM_MAP_T3_CH2 0x0FC0 \
  CONFIG.USER_REG_HBM_MAP_T3_CH3 0x0FC0 \
  CONFIG.USER_REG_HBM_MAP_T3_CH4 0x0FC0 \
  CONFIG.USER_REG_HBM_MAP_T3_CH5 0x0FC0 \
  CONFIG.USER_REG_HBM_MAP_T3_CH6 0x0FC0 \
  CONFIG.USER_REG_HBM_MAP_T3_CH7 0x0FC0 \
  CONFIG.USER_REG_HBM_MAP_T3_CH8 0x0FC0 \
  CONFIG.USER_REG_HBM_MAP_T3_CH9 0x0FC0 \
  CONFIG.USER_REG_HBM_MAP_T3_CH10 0x0FC0 \
  CONFIG.USER_REG_HBM_MAP_T3_CH11 0x0FC0 \
  CONFIG.USER_REG_HBM_MAP_T3_CH12 0x0FC0 \
  CONFIG.USER_REG_HBM_MAP_T3_CH13 0x0FC0 \
  CONFIG.USER_REG_HBM_MAP_T3_CH14 0x0FC0 \
  CONFIG.USER_REG_HBM_MAP_T3_CH15 0x0FC0 \
  CONFIG.USER_REG_MODE_SELECT 0x0020 \
  CONFIG.USER_REG_OUTSTANDING_RD_TXN 0x40 \
  CONFIG.USER_REG_OUTSTANDING_WR_TXN 0x40 \
  CONFIG.USER_REG_PRIORITY 0x0 \
  CONFIG.USER_REG_RD_AXPROT_SEL 0x00 \
  CONFIG.USER_REG_RD_RATE_CREDIT_DROP 0x004 \
  CONFIG.USER_REG_RD_RATE_CREDIT_LIMIT 0x0100 \
  CONFIG.USER_REG_RD_VCA_TOKEN0 0x33 \
  CONFIG.USER_REG_RPOISON_TO_SLVERR 0x0 \
  CONFIG.USER_REG_RROB_RAM_SETTING 0x012 \
  CONFIG.USER_REG_SMID_SEL 0x00000 \
  CONFIG.USER_REG_SRC 0x980 \
  CONFIG.USER_REG_TBASE_AXI_TIMEOUT 0x1 \
  CONFIG.USER_REG_TBASE_MODE_RLIMIT_RD 0x2 \
  CONFIG.USER_REG_TBASE_MODE_RLIMIT_WR 0x2 \
  CONFIG.USER_REG_TBASE_TRK_TIMEOUT 0x1 \
  CONFIG.USER_REG_VC_MAP 0x6A8 \
  CONFIG.USER_REG_WBUF_LAUNCH_SIZE 0x10 \
  CONFIG.USER_REG_WBUF_RAM_SETTING 0x012 \
  CONFIG.USER_REG_WR_AXPROT_SEL 0x00 \
  CONFIG.USER_REG_WR_RATE_CREDIT_DROP 0x004 \
  CONFIG.USER_REG_WR_RATE_CREDIT_LIMIT 0x0100 \
  CONFIG.USER_REG_WR_VCA_TOKEN0 0xFF \
] [get_bd_cells S00_AXI_nmu]
create_bd_cell -type ip -vlnv xilinx.com:ip:noc_nmu:1.0 HBM28_AXI_nmu
set_property -dict [list \
  CONFIG.ATTR_FILE nocattrs.dat \
  CONFIG.IS_HBM true \
  CONFIG.NOC_FREQ 1000 \
  CONFIG.USER_NOC_CATEGORY PL \
  CONFIG.USER_NOC_DATA512_WIDTH 256 \
  CONFIG.USER_NOC_NMU_WIDTH 256 \
  CONFIG.USER_PHYS_NAME NOC_NMU_HBM2E_X59Y0 \
  CONFIG.USER_REG_ADDR_DST0 0x00000 \
  CONFIG.USER_REG_ADDR_DST1 0x00000 \
  CONFIG.USER_REG_ADDR_DST2 0x00000 \
  CONFIG.USER_REG_ADDR_DST3 0x00000 \
  CONFIG.USER_REG_ADDR_DST4 0x00000 \
  CONFIG.USER_REG_ADDR_DST5 0x00000 \
  CONFIG.USER_REG_ADDR_DST6 0x00000 \
  CONFIG.USER_REG_ADDR_DST7 0x00000 \
  CONFIG.USER_REG_ADDR_DST8 0x00000 \
  CONFIG.USER_REG_ADDR_DST9 0x00000 \
  CONFIG.USER_REG_ADDR_DST10 0x00000 \
  CONFIG.USER_REG_ADDR_DST11 0x00000 \
  CONFIG.USER_REG_ADDR_DST12 0x00000 \
  CONFIG.USER_REG_ADDR_DST13 0x00000 \
  CONFIG.USER_REG_ADDR_DST14 0x00000 \
  CONFIG.USER_REG_ADDR_DST15 0x00000 \
  CONFIG.USER_REG_ADDR_ENABLE 0x0000 \
  CONFIG.USER_REG_ADDR_MADDR0 0x00000000 \
  CONFIG.USER_REG_ADDR_MADDR1 0x00000000 \
  CONFIG.USER_REG_ADDR_MADDR2 0x00000000 \
  CONFIG.USER_REG_ADDR_MADDR3 0x00000000 \
  CONFIG.USER_REG_ADDR_MADDR4 0x00000000 \
  CONFIG.USER_REG_ADDR_MADDR5 0x00000000 \
  CONFIG.USER_REG_ADDR_MADDR6 0x00000000 \
  CONFIG.USER_REG_ADDR_MADDR7 0x00000000 \
  CONFIG.USER_REG_ADDR_MADDR8 0x00000000 \
  CONFIG.USER_REG_ADDR_MADDR9 0x00000000 \
  CONFIG.USER_REG_ADDR_MADDR10 0x00000000 \
  CONFIG.USER_REG_ADDR_MADDR11 0x00000000 \
  CONFIG.USER_REG_ADDR_MADDR12 0x00000000 \
  CONFIG.USER_REG_ADDR_MADDR13 0x00000000 \
  CONFIG.USER_REG_ADDR_MADDR14 0x00000000 \
  CONFIG.USER_REG_ADDR_MADDR15 0x00000000 \
  CONFIG.USER_REG_ADDR_MASK0 0x00000000 \
  CONFIG.USER_REG_ADDR_MASK1 0x00000000 \
  CONFIG.USER_REG_ADDR_MASK2 0x00000000 \
  CONFIG.USER_REG_ADDR_MASK3 0x00000000 \
  CONFIG.USER_REG_ADDR_MASK4 0x00000000 \
  CONFIG.USER_REG_ADDR_MASK5 0x00000000 \
  CONFIG.USER_REG_ADDR_MASK6 0x00000000 \
  CONFIG.USER_REG_ADDR_MASK7 0x00000000 \
  CONFIG.USER_REG_ADDR_MASK8 0x00000000 \
  CONFIG.USER_REG_ADDR_MASK9 0x00000000 \
  CONFIG.USER_REG_ADDR_MASK10 0x00000000 \
  CONFIG.USER_REG_ADDR_MASK11 0x00000000 \
  CONFIG.USER_REG_ADDR_MASK12 0x00000000 \
  CONFIG.USER_REG_ADDR_MASK13 0x00000000 \
  CONFIG.USER_REG_ADDR_MASK14 0x00000000 \
  CONFIG.USER_REG_ADDR_MASK15 0x00000000 \
  CONFIG.USER_REG_ADDR_REMAP 0x0000 \
  CONFIG.USER_REG_ADDR_RPADDR0 0x00000000 \
  CONFIG.USER_REG_ADDR_RPADDR1 0x00000000 \
  CONFIG.USER_REG_ADDR_RPADDR2 0x00000000 \
  CONFIG.USER_REG_ADDR_RPADDR3 0x00000000 \
  CONFIG.USER_REG_ADDR_RPADDR4 0x00000000 \
  CONFIG.USER_REG_ADDR_RPADDR5 0x00000000 \
  CONFIG.USER_REG_ADDR_RPADDR6 0x00000000 \
  CONFIG.USER_REG_ADDR_RPADDR7 0x00000000 \
  CONFIG.USER_REG_ADDR_RPADDR8 0x00000000 \
  CONFIG.USER_REG_ADDR_RPADDR9 0x00000000 \
  CONFIG.USER_REG_ADDR_RPADDR10 0x00000000 \
  CONFIG.USER_REG_ADDR_RPADDR11 0x00000000 \
  CONFIG.USER_REG_ADDR_RPADDR12 0x00000000 \
  CONFIG.USER_REG_ADDR_RPADDR13 0x00000000 \
  CONFIG.USER_REG_ADDR_RPADDR14 0x00000000 \
  CONFIG.USER_REG_ADDR_RPADDR15 0x00000000 \
  CONFIG.USER_REG_ADR_MAP_CPM 0x0FC0 \
  CONFIG.USER_REG_ADR_MAP_FPD_AFI_0 0x0FC0 \
  CONFIG.USER_REG_ADR_MAP_FPD_AFI_1 0x0FC0 \
  CONFIG.USER_REG_ADR_MAP_LPD_AFI_FS 0x0FC0 \
  CONFIG.USER_REG_ADR_MAP_ME_ARRAY_0 0x0FC0 \
  CONFIG.USER_REG_ADR_MAP_ME_ARRAY_1 0x0FC0 \
  CONFIG.USER_REG_ADR_MAP_ME_ARRAY_2 0x0FC0 \
  CONFIG.USER_REG_ADR_MAP_ME_ARRAY_3 0x0FC0 \
  CONFIG.USER_REG_ADR_MAP_PCIE 0x0FC0 \
  CONFIG.USER_REG_ADR_MAP_PMC 0x0FC0 \
  CONFIG.USER_REG_ADR_MAP_PMC_ALIAS_0 0x0FC0 \
  CONFIG.USER_REG_ADR_MAP_PMC_ALIAS_1 0x0FC0 \
  CONFIG.USER_REG_ADR_MAP_PMC_ALIAS_2 0x0FC0 \
  CONFIG.USER_REG_ADR_MAP_PMC_ALIAS_3 0x0FC0 \
  CONFIG.USER_REG_ADR_MAP_QSPI 0x0FC0 \
  CONFIG.USER_REG_ADR_MAP_STM_GIC 0x0FC0 \
  CONFIG.USER_REG_ADR_MAP_USER_ID0 0x0000 \
  CONFIG.USER_REG_ADR_MAP_USER_ID1 0x0000 \
  CONFIG.USER_REG_ADR_MAP_USER_ID2 0x0000 \
  CONFIG.USER_REG_ADR_MAP_USER_ID3 0x0000 \
  CONFIG.USER_REG_ADR_MAP_USER_ID4 0x0000 \
  CONFIG.USER_REG_ADR_MAP_USER_ID5 0x0000 \
  CONFIG.USER_REG_ADR_MAP_USER_ID6 0x0000 \
  CONFIG.USER_REG_ADR_MAP_USER_ID7 0x0000 \
  CONFIG.USER_REG_ADR_MAP_XPDS 0x0FC0 \
  CONFIG.USER_REG_AXI_LOOPBACK 0x00 \
  CONFIG.USER_REG_AXI_NON_MOD_DISABLE 0x0 \
  CONFIG.USER_REG_AXI_PAR_CHK 0x0 \
  CONFIG.USER_REG_CHOPSIZE 0xA \
  CONFIG.USER_REG_DDR_ADR_MAP0 0x01FFF \
  CONFIG.USER_REG_DDR_ADR_MAP1 0x01FFF \
  CONFIG.USER_REG_DDR_ADR_MAP2 0x01FFF \
  CONFIG.USER_REG_DDR_ADR_MAP3 0x01FFF \
  CONFIG.USER_REG_DDR_ADR_MAP4 0x01FFF \
  CONFIG.USER_REG_DDR_ADR_MAP5 0x01FFF \
  CONFIG.USER_REG_DDR_ADR_MAP6 0x01FFF \
  CONFIG.USER_REG_DDR_DST_MAP0 0xFC0 \
  CONFIG.USER_REG_DDR_DST_MAP1 0xFC0 \
  CONFIG.USER_REG_DDR_DST_MAP2 0xFC0 \
  CONFIG.USER_REG_DDR_DST_MAP3 0xFC0 \
  CONFIG.USER_REG_DDR_DST_MAP4 0xFC0 \
  CONFIG.USER_REG_DDR_DST_MAP5 0xFC0 \
  CONFIG.USER_REG_DDR_DST_MAP6 0xFC0 \
  CONFIG.USER_REG_DDR_DST_MAP7 0xFC0 \
  CONFIG.USER_REG_DWIDTH 0x5 \
  CONFIG.USER_REG_ECC_CHK_EN 0x1 \
  CONFIG.USER_REG_HBM_MAP_T0_CH0 0x0FC0 \
  CONFIG.USER_REG_HBM_MAP_T0_CH1 0x0FC0 \
  CONFIG.USER_REG_HBM_MAP_T0_CH2 0x0FC0 \
  CONFIG.USER_REG_HBM_MAP_T0_CH3 0x0FC0 \
  CONFIG.USER_REG_HBM_MAP_T0_CH4 0x0FC0 \
  CONFIG.USER_REG_HBM_MAP_T0_CH5 0x0FC0 \
  CONFIG.USER_REG_HBM_MAP_T0_CH6 0x0FC0 \
  CONFIG.USER_REG_HBM_MAP_T0_CH7 0x0FC0 \
  CONFIG.USER_REG_HBM_MAP_T0_CH8 0x0FC0 \
  CONFIG.USER_REG_HBM_MAP_T0_CH9 0x0FC0 \
  CONFIG.USER_REG_HBM_MAP_T0_CH10 0x0FC0 \
  CONFIG.USER_REG_HBM_MAP_T0_CH11 0x0FC0 \
  CONFIG.USER_REG_HBM_MAP_T0_CH12 0x0FC0 \
  CONFIG.USER_REG_HBM_MAP_T0_CH13 0x0FC0 \
  CONFIG.USER_REG_HBM_MAP_T0_CH14 0x0FC0 \
  CONFIG.USER_REG_HBM_MAP_T0_CH15 0x0FC0 \
  CONFIG.USER_REG_HBM_MAP_T1_CH0 0x0FC0 \
  CONFIG.USER_REG_HBM_MAP_T1_CH1 0x0FC0 \
  CONFIG.USER_REG_HBM_MAP_T1_CH2 0x0FC0 \
  CONFIG.USER_REG_HBM_MAP_T1_CH3 0x0FC0 \
  CONFIG.USER_REG_HBM_MAP_T1_CH4 0x0FC0 \
  CONFIG.USER_REG_HBM_MAP_T1_CH5 0x0FC0 \
  CONFIG.USER_REG_HBM_MAP_T1_CH6 0x0FC0 \
  CONFIG.USER_REG_HBM_MAP_T1_CH7 0x0FC0 \
  CONFIG.USER_REG_HBM_MAP_T1_CH8 0x0FC0 \
  CONFIG.USER_REG_HBM_MAP_T1_CH9 0x0FC0 \
  CONFIG.USER_REG_HBM_MAP_T1_CH10 0x0FC0 \
  CONFIG.USER_REG_HBM_MAP_T1_CH11 0x0FC0 \
  CONFIG.USER_REG_HBM_MAP_T1_CH12 0x1880 \
  CONFIG.USER_REG_HBM_MAP_T1_CH13 0x0FC0 \
  CONFIG.USER_REG_HBM_MAP_T1_CH14 0x0FC0 \
  CONFIG.USER_REG_HBM_MAP_T1_CH15 0x0FC0 \
  CONFIG.USER_REG_HBM_MAP_T2_CH0 0x0FC0 \
  CONFIG.USER_REG_HBM_MAP_T2_CH1 0x0FC0 \
  CONFIG.USER_REG_HBM_MAP_T2_CH2 0x0FC0 \
  CONFIG.USER_REG_HBM_MAP_T2_CH3 0x0FC0 \
  CONFIG.USER_REG_HBM_MAP_T2_CH4 0x0FC0 \
  CONFIG.USER_REG_HBM_MAP_T2_CH5 0x0FC0 \
  CONFIG.USER_REG_HBM_MAP_T2_CH6 0x0FC0 \
  CONFIG.USER_REG_HBM_MAP_T2_CH7 0x0FC0 \
  CONFIG.USER_REG_HBM_MAP_T2_CH8 0x0FC0 \
  CONFIG.USER_REG_HBM_MAP_T2_CH9 0x0FC0 \
  CONFIG.USER_REG_HBM_MAP_T2_CH10 0x0FC0 \
  CONFIG.USER_REG_HBM_MAP_T2_CH11 0x0FC0 \
  CONFIG.USER_REG_HBM_MAP_T2_CH12 0x0FC0 \
  CONFIG.USER_REG_HBM_MAP_T2_CH13 0x0FC0 \
  CONFIG.USER_REG_HBM_MAP_T2_CH14 0x0FC0 \
  CONFIG.USER_REG_HBM_MAP_T2_CH15 0x0FC0 \
  CONFIG.USER_REG_HBM_MAP_T3_CH0 0x0FC0 \
  CONFIG.USER_REG_HBM_MAP_T3_CH1 0x0FC0 \
  CONFIG.USER_REG_HBM_MAP_T3_CH2 0x0FC0 \
  CONFIG.USER_REG_HBM_MAP_T3_CH3 0x0FC0 \
  CONFIG.USER_REG_HBM_MAP_T3_CH4 0x0FC0 \
  CONFIG.USER_REG_HBM_MAP_T3_CH5 0x0FC0 \
  CONFIG.USER_REG_HBM_MAP_T3_CH6 0x0FC0 \
  CONFIG.USER_REG_HBM_MAP_T3_CH7 0x0FC0 \
  CONFIG.USER_REG_HBM_MAP_T3_CH8 0x0FC0 \
  CONFIG.USER_REG_HBM_MAP_T3_CH9 0x0FC0 \
  CONFIG.USER_REG_HBM_MAP_T3_CH10 0x0FC0 \
  CONFIG.USER_REG_HBM_MAP_T3_CH11 0x0FC0 \
  CONFIG.USER_REG_HBM_MAP_T3_CH12 0x0FC0 \
  CONFIG.USER_REG_HBM_MAP_T3_CH13 0x0FC0 \
  CONFIG.USER_REG_HBM_MAP_T3_CH14 0x0FC0 \
  CONFIG.USER_REG_HBM_MAP_T3_CH15 0x0FC0 \
  CONFIG.USER_REG_HPHY_MODE 0x0 \
  CONFIG.USER_REG_MODE_SELECT 0x0020 \
  CONFIG.USER_REG_OUTSTANDING_RD_TXN 0x40 \
  CONFIG.USER_REG_OUTSTANDING_WR_TXN 0x40 \
  CONFIG.USER_REG_PRIORITY 0x0 \
  CONFIG.USER_REG_QOS 0x00 \
  CONFIG.USER_REG_RD_AXPROT_SEL 0x00 \
  CONFIG.USER_REG_RD_RATE_CREDIT_DROP 0x004 \
  CONFIG.USER_REG_RD_RATE_CREDIT_LIMIT 0x0100 \
  CONFIG.USER_REG_RD_VCA_TOKEN0 0x39 \
  CONFIG.USER_REG_RPOISON_TO_SLVERR 0x0 \
  CONFIG.USER_REG_RROB_RAM_SETTING 0x012 \
  CONFIG.USER_REG_SMID_SEL 0x00000 \
  CONFIG.USER_REG_SRC 0x8C0 \
  CONFIG.USER_REG_TBASE_AXI_TIMEOUT 0x1 \
  CONFIG.USER_REG_TBASE_MODE_RLIMIT_RD 0x2 \
  CONFIG.USER_REG_TBASE_MODE_RLIMIT_WR 0x2 \
  CONFIG.USER_REG_TBASE_TRK_TIMEOUT 0x1 \
  CONFIG.USER_REG_VC_MAP 0x6A8 \
  CONFIG.USER_REG_WBUF_LAUNCH_SIZE 0x10 \
  CONFIG.USER_REG_WBUF_RAM_SETTING 0x012 \
  CONFIG.USER_REG_WR_AXPROT_SEL 0x00 \
  CONFIG.USER_REG_WR_RATE_CREDIT_DROP 0x004 \
  CONFIG.USER_REG_WR_RATE_CREDIT_LIMIT 0x0100 \
  CONFIG.USER_REG_WR_VCA_TOKEN0 0xFF \
] [get_bd_cells HBM28_AXI_nmu]
create_bd_cell -type ip -vlnv xilinx.com:ip:noc_nmu:1.0 HBM27_AXI_nmu
